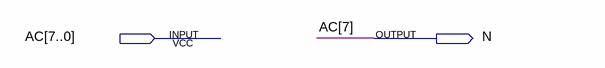
[diagram p0: schematic sheet]
// Quartus schematic flag_n.bdf as structural Verilog: 0 symbols, 2 pins
module flag_n (
  input  [7:0] AC,
  output N
);


  assign N = AC[7];
endmodule
